# Altium schematic sheet Strum.SchDoc
size C; SheetNumber: 1; SheetTotal: 1
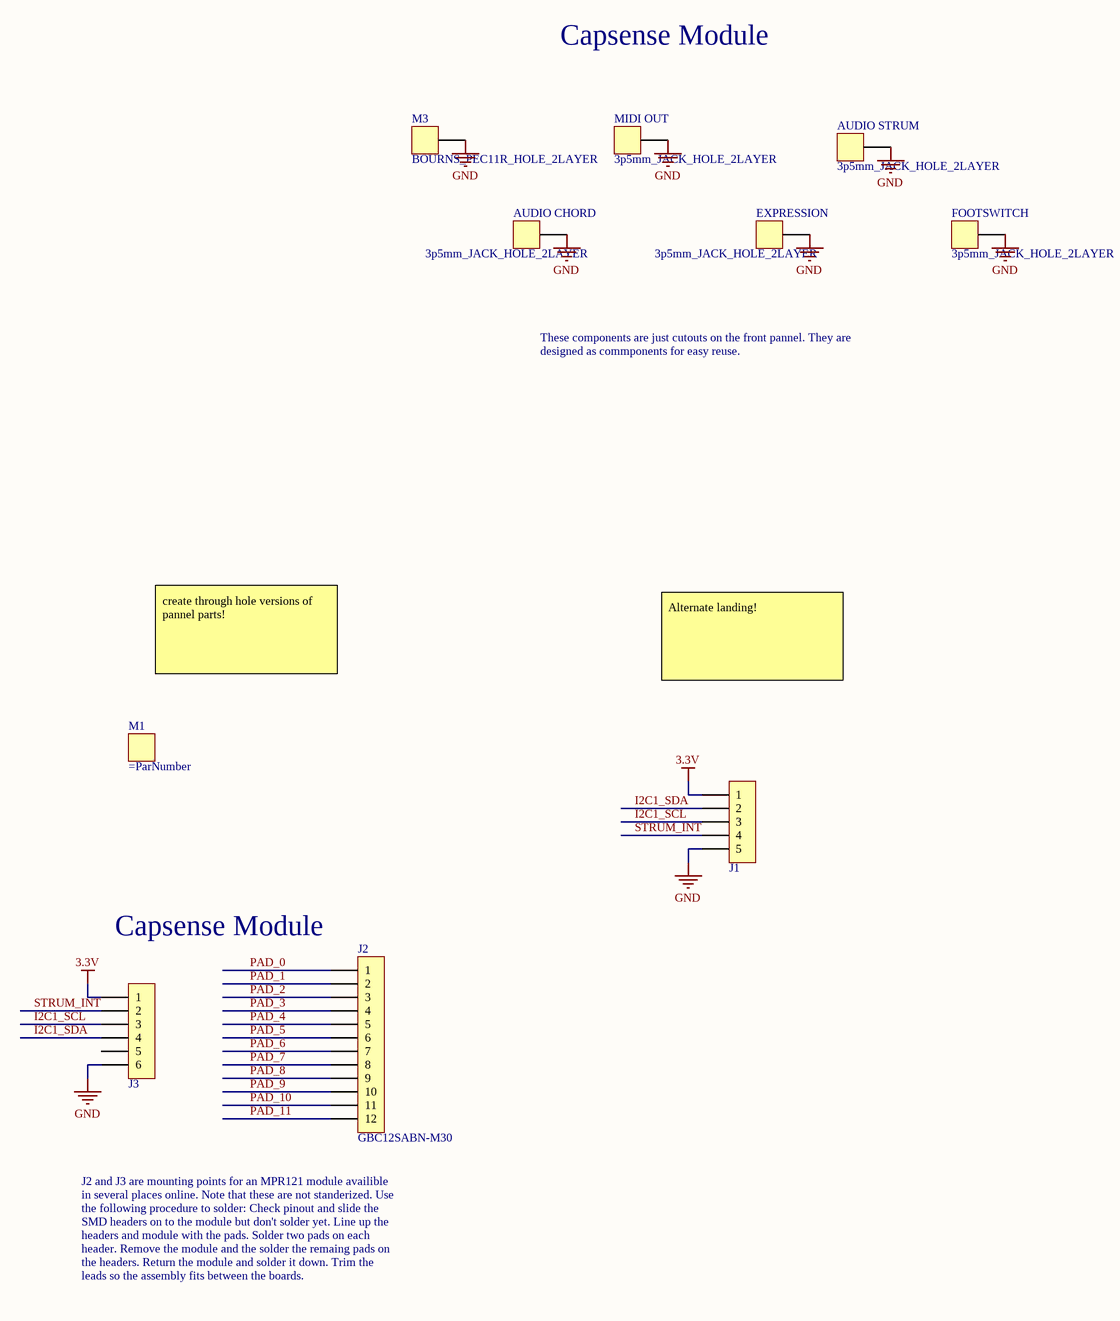
[diagram p0: Strum.SchDoc]

## Parts
AUDIO_CHORD  3p5mm_JACK_HOLE_2LAYER  [3p5mm_JACK_HOLE_2LAYER]
AUDIO_STRUM  3p5mm_JACK_HOLE_2LAYER  [3p5mm_JACK_HOLE_2LAYER]
EXPRESSION  3p5mm_JACK_HOLE_2LAYER  [3p5mm_JACK_HOLE_2LAYER]
FOOTSWITCH  3p5mm_JACK_HOLE_2LAYER  [3p5mm_JACK_HOLE_2LAYER]
J1  0532610571  [MOLEX_0532610571]  (value not drawn)
J2  GBC12SABN-M30  [SULLINS_GBC12SABN-M30]
J3  GBC06SABN-M30  [SULLINS_GBC06SABN-M30]  (value not drawn)
M1  (no value)  [OLEDp96MOD_HOLE]
M3  BOURNS_PEC11R_HOLE_2LAYER  [BOURNS_PEC11R_HOLE_2LAYER]
MIDI_OUT  3p5mm_JACK_HOLE_2LAYER  [3p5mm_JACK_HOLE_2LAYER]

## Nets
3.3V: J1.1 J3.1
GND: AUDIO_CHORD.1 AUDIO_STRUM.1 EXPRESSION.1 FOOTSWITCH.1 J1.5 J3.6 M3.1 MIDI_OUT.1
I2C1_SCL: J1.3 J3.3
I2C1_SDA: J1.2 J3.4
PAD_0: J2.1
PAD_1: J2.2
PAD_2: J2.3
PAD_3: J2.4
PAD_4: J2.5
PAD_5: J2.6
PAD_6: J2.7
PAD_7: J2.8
PAD_8: J2.9
PAD_9: J2.10
PAD_10: J2.11
PAD_11: J2.12
STRUM_INT: J1.4 J3.2

Not connected (* = marked no-connect by the designer): J3 5

## Notes on the sheet
- Capsense Module
- These components are just cutouts on the front pannel. They are designed as commponents for easy reuse.
- create through hole versions of pannel parts!
- Alternate landing!
- J2 and J3 are mounting points for an MPR121 module availible in several places online. Note that these are not standerized. Use the following procedure to solder: Check pinout and slide the SMD headers on to the module but don't solder yet. Line up the headers and module with the pads. Solder two pads on each header. Remove the module and the solder the remaing pads on the headers. Return the module and solder it down. Trim the leads so the assembly fits between the boards.
- Title:
- This work is licensed under a Creative Commons Attribution 4.0 International License. Derivative works should remove all Sophistry branding and ‘é’ watermark.
- Date:
- Engineer:
- Revision:
- Codename:
- Time:
- Variant:
- Sheet
- of

## Library data of the parts
J1 = 0532610571: CONN HEADER SMD R/A 5POS 1.25MM; Manufacturer Part Number: WM7623CT-ND; Manufacturer: Molex; PartNumber: 0532610571; Supplier 1: Digi-Key; Supplier 2: Mouser; HelpURL: https://www.molex.com/pdm_docs/sd/532610571_sd.pdf
J2 = GBC12SABN-M30: CONN HEADER SMD 12POS 2.54MM; Manufacturer: Sullins Connector Solutions; PartNumber: GBC12SABN-M30; Supplier 1: Digi-Key; Supplier 2: Mouser; HelpURL: https://s3.amazonaws.com/catalogspreads-pdf/PAGE112-113%20.100%20MALE%20HDR.pdf; Supplier Part Number 1: S1033E-12-ND; Manufacturer Part Number: GBC12SABN-M30
J3 = GBC06SABN-M30: CONN HEADER SMD 6POS 2.54MM; Manufacturer: Sullins Connector Solutions; PartNumber: GBC06SABN-M30; Supplier 1: Digi-Key; Supplier 2: Mouser; HelpURL: https://s3.amazonaws.com/catalogspreads-pdf/PAGE112-113%20.100%20MALE%20HDR.pdf; Supplier Part Number 1: S1033E-06-ND; Manufacturer Part Number: GBC06SABN-M30
M1 = OLEDp96MOD_HOLE: p95_OLED_MODULE_HOLE; PartNumber: OLEDp96MOD_HOLE; Manufacturer Part Number: OLEDp96MOD_HOLE
AUDIO_CHORD AUDIO_STRUM EXPRESSION FOOTSWITCH MIDI_OUT = 3p5mm_JACK_HOLE_2LAYER: PartNumber: 3p5mm_JACK_HOLE_2LAYER; Manufacturer Part Number: 3p5mm_JACK_HOLE_2LAYER
M3 = BOURNS_PEC11R_HOLE_2LAYER: PartNumber: BOURNS_PEC11R_HOLE_2LAYER; Manufacturer Part Number: BOURNS_PEC11R_HOLE_2LAYER